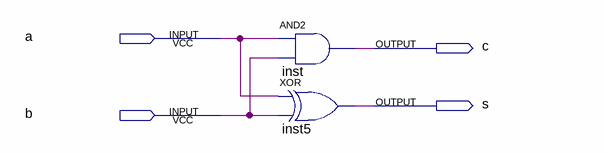
[diagram p0: schematic sheet]
// Quartus schematic half_adder.bdf as structural Verilog: 2 symbols, 4 pins
module half_adder (
  input  a,
  input  b,
  output c,
  output s
);

  and inst (c, a, b);
  xor inst5 (s, a, b);
endmodule
